# EAGLE design TLC5955 (EAGLE 7.4.0)
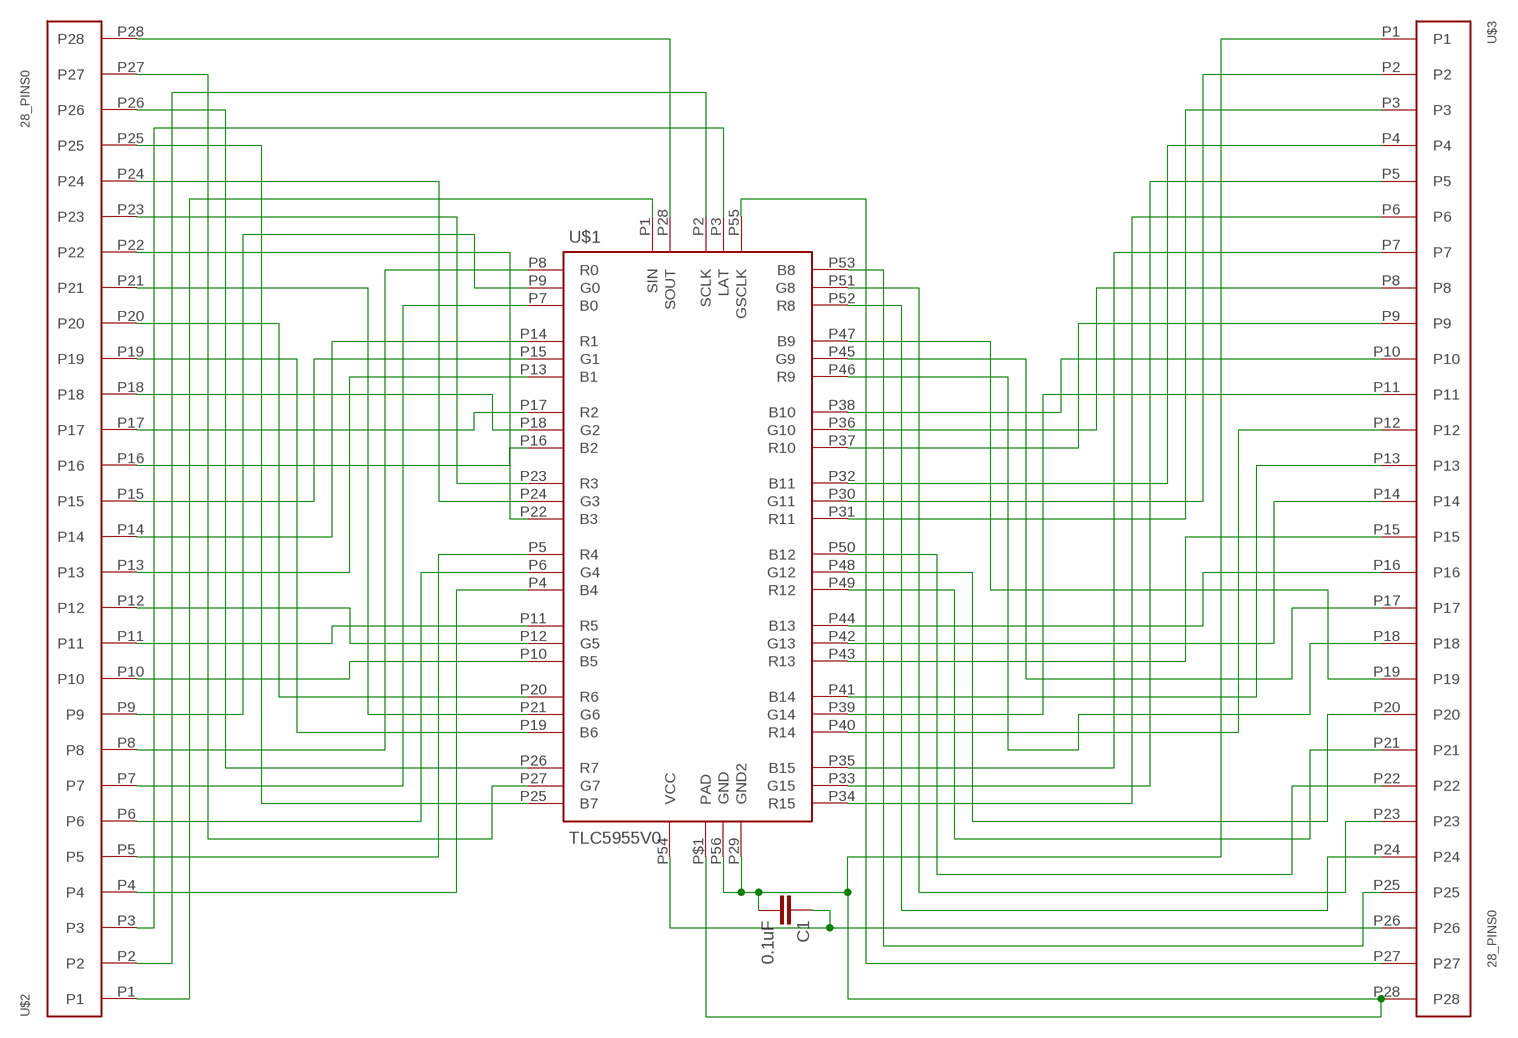
[diagram p0: schematic, sheet 1]

## Parts
C1  0.1uF  0.1UF-25V(+80/-20%)(0603)  [0603-CAP]
U$1  TLC5955V0  [56-HTSSOP]
U$2  28_PINS0  [28PIN_HOLES]
U$3  28_PINS0  [28PIN_HOLES]

## Nets
N$1: U$1.P4(B4) U$2.P4
N$2: U$1.P5(R4) U$2.P5
N$3: U$1.P6(G4) U$2.P6
N$4: U$1.P7(B0) U$2.P7
N$5: U$1.P8(R0) U$2.P8
N$6: U$1.P21(G6) U$2.P21
N$7: U$1.P10(B5) U$2.P10
N$8: U$1.P11(R5) U$2.P11
N$9: U$1.P12(G5) U$2.P12
N$10: U$1.P13(B1) U$2.P13
N$11: U$1.P14(R1) U$2.P14
N$12: U$1.P15(G1) U$2.P15
N$13: U$1.P16(B2) U$2.P16
N$14: U$1.P17(R2) U$2.P17
N$15: U$1.P18(G2) U$2.P18
N$16: U$1.P19(B6) U$2.P19
N$17: U$1.P20(R6) U$2.P20
N$18: U$1.P22(B3) U$2.P22
N$19: U$1.P23(R3) U$2.P23
N$20: U$1.P24(G3) U$2.P24
N$21: U$1.P9(G0) U$2.P9
N$22: U$1.P25(B7) U$2.P25
N$23: U$1.P26(R7) U$2.P26
N$24: U$1.P28(SOUT) U$2.P28
N$25: U$1.P27(G7) U$2.P27
N$26: U$1.P1(SIN) U$2.P1
N$27: U$1.P2(SCLK) U$2.P2
N$28: U$1.P3(LAT) U$2.P3
N$30: U$1.P47(B9) U$3.P19
N$31: C1.1 U$1.P54(VCC) U$3.P26
N$33: U$1.P30(G11) U$3.P2
N$34: U$1.P31(R11) U$3.P3
N$35: U$1.P32(B11) U$3.P4
N$36: U$1.P33(G15) U$3.P5
N$37: U$1.P34(R15) U$3.P6
N$38: U$1.P35(B15) U$3.P7
N$39: U$1.P36(G10) U$3.P8
N$40: U$1.P37(R10) U$3.P9
N$41: U$1.P38(B10) U$3.P10
N$42: U$1.P39(G14) U$3.P11
N$43: U$1.P40(R14) U$3.P12
N$44: U$1.P41(B14) U$3.P13
N$45: U$1.P42(G13) U$3.P14
N$46: U$1.P43(R13) U$3.P15
N$47: U$1.P44(B13) U$3.P16
N$48: U$1.P45(G9) U$3.P17
N$49: U$1.P46(R9) U$3.P18
N$50: U$1.P48(G12) U$3.P20
N$51: U$1.P49(R12) U$3.P21
N$52: U$1.P50(B12) U$3.P22
N$53: U$1.P51(G8) U$3.P23
N$54: U$1.P52(R8) U$3.P24
N$55: U$1.P53(B8) U$3.P25
N$56: U$1.P55(GSCLK) U$3.P27
N$57: C1.2 U$1.P29(GND2) U$1.P56(GND) U$1.P$1(PAD) U$3.P1 U$3.P28

## Library data of the parts
C1 = SparkFun-Capacitors:0.1UF-25V(+80/-20%)(0603): CAP-00810 Ceramic Standard decoupling cap; PROD_ID: CAP-00810
U$1 = WallerLabLib:TLC5955
U$2 U$3 = WallerLabLib:28_PINS

## Board
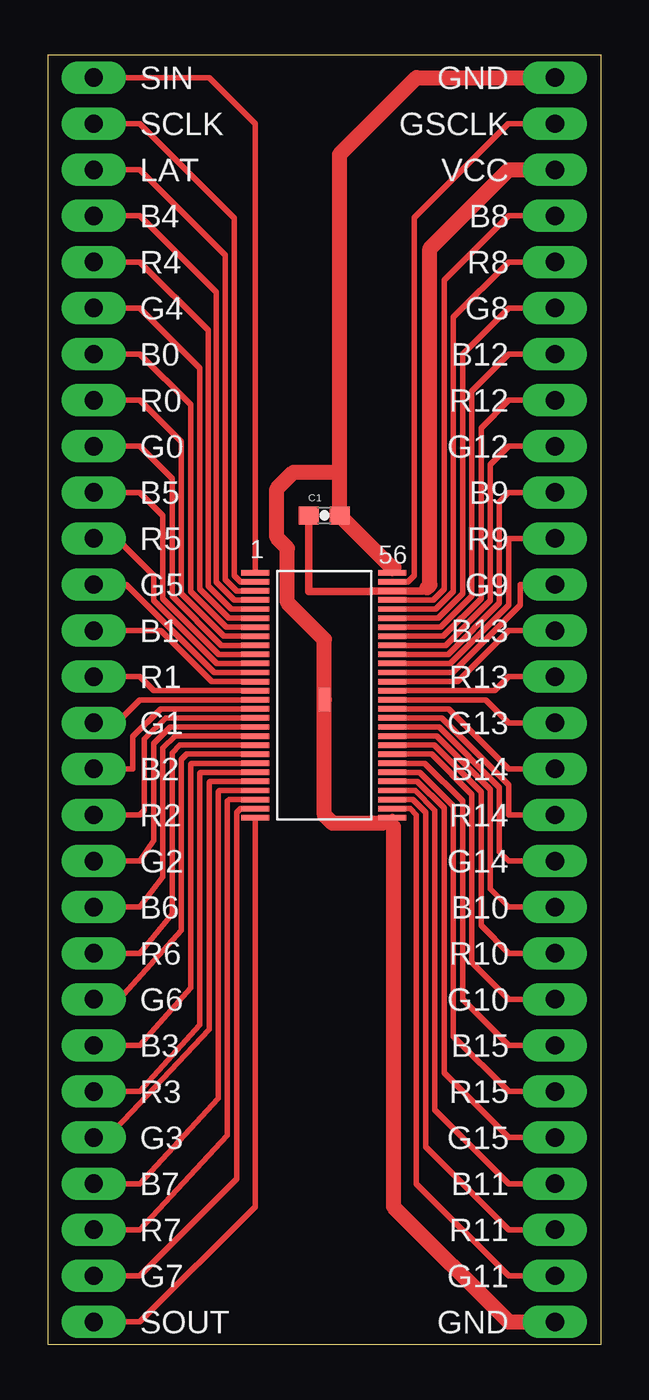
[diagram p1: board, top side]

Size 30.48 x 71.12 mm. Coordinates in mm from the lower left corner, seen from the top.
Outline: 0,71.11 0,0 30.48,0 30.48,71.12 0,71.12
Copper layers (1*16): Top 0.035mm / dielectric 1.5mm / Bottom 0.035mm
Design rules "default": minimum track width 10mil, minimum drill 24mil, track to track 8mil, track to pad 8mil, pad to pad 8mil, via to via 8mil, smd to smd 8mil, copper to edge 40mil, drill to drill 8mil, minimum pad ring 10mil, minimum via ring 8mil, stop-mask expansion 4mil, vias tented up to drill 0mil, thermal gap 10mil

### Footprints (pad centres in the part's own frame; a part is rotated, then mirrored left to right if it is on the bottom)
0603-CAP = smd 1.1 x 1: 1 -0.85,0; 2 0.85,0
56-HTSSOP = smd 0.3 x 1.55: P1 -7,-3.8; P2 -6.5,-3.8; P3 -6,-3.8; P4 -5.5,-3.8; P5 -5,-3.8; P6 -4.5,-3.8; P7 -4,-3.8; P8 -3.5,-3.8; P9 -3,-3.8; P10 -2.5,-3.8; P11 -2,-3.8; P12 -1.5,-3.8; P13 -1,-3.8; P14 -0.5,-3.8; P15 0,-3.8; P16 0.5,-3.8; P17 1,-3.8; P18 1.5,-3.8; P19 2,-3.8; P20 2.5,-3.8; P21 3,-3.8; P22 3.5,-3.8; P23 4,-3.8; P24 4.5,-3.8; P25 5,-3.8; P26 5.5,-3.8; P27 6,-3.8; P28 6.5,-3.8; P29 6.5,3.75; P30 6,3.75; P31 5.5,3.75; P32 5,3.75; P33 4.5,3.75; P34 4,3.75; P35 3.5,3.75; P36 3,3.75; P37 2.5,3.75; P38 2,3.75; P39 1.5,3.75; P40 1,3.75; P41 0.5,3.75; P42 0,3.75; P43 -0.5,3.75; P44 -1,3.75; P45 -1.5,3.75; P46 -2,3.75; P47 -2.5,3.75; P48 -3,3.75; P49 -3.5,3.75; P50 -4,3.75; P51 -4.5,3.75; P52 -5,3.75; P53 -5.5,3.75; P54 -6,3.75; P55 -6.5,3.75; P56 -7,3.75 | smd 1.27 x 0.635: P$1 0,0
28PIN_HOLES = drill 1.016 pad 1.778 long: P1 -34.29,0; P2 -31.75,0; P3 -29.21,0; P4 -26.67,0; P5 -24.13,0; P6 -21.59,0; P7 -19.05,0; P8 -16.51,0; P9 -13.97,0; P10 -11.43,0; P11 -8.89,0; P12 -6.35,0; P13 -3.81,0; P14 -1.27,0; P15 1.27,0; P16 3.81,0; P17 6.35,0; P18 8.89,0; P19 11.43,0; P20 13.97,0; P21 16.51,0; P22 19.05,0; P23 21.59,0; P24 24.13,0; P25 26.67,0; P26 29.21,0; P27 31.75,0; P28 34.29,0

### Placement (x,y rotation side)
C1  10uF  [0603-CAP]  15.24,45.72 0 top
U$1  15.24,35.56 270 top
U$2  2.54,35.56 270 top
U$3  27.94,35.56 90 top

### Tracks (layer width: path | path; a pad name or v marks a point on that pad's centre or on a via)
N$1
  Top 0.305: U$1.P4 10.27,41.06 9.3,42.04 9.3,58.01 5.08,62.23 U$2.P4
N$2
  Top 0.305: U$1.P5 10.11,40.56 8.84,41.83 8.84,55.93 5.08,59.69 U$2.P5
N$3
  Top 0.305: U$1.P6 9.98,40.06 8.38,41.66 8.38,53.85 5.08,57.15 U$2.P6
N$4
  Top 0.305: U$1.P7 9.84,39.56 7.87,41.53 7.87,51.82 5.08,54.61 U$2.P7
N$5
  Top 0.305: U$1.P8 9.71,39.06 7.37,41.4 7.37,49.78 5.08,52.07 U$2.P8
N$6
  Top 0.305: U$2.P21 3.94,19.05 7.37,22.86 7.37,32.26 7.67,32.56 U$1.P21
N$7
  Top 0.305: U$1.P10 9.44,38.06 6.35,41.15 6.35,45.72 5.08,46.99 U$2.P10
N$8
  Top 0.305: U$1.P11 9.3,37.56 5.84,41.02 5.84,42.42 3.81,44.45 U$2.P11
N$9
  Top 0.305: U$1.P12 9.17,37.06 4.32,41.91 U$2.P12
N$10
  Top 0.305: U$1.P13 9.03,36.56 6.22,39.37 U$2.P13
N$11
  Top 0.305: U$1.P14 5.85,36.06 5.08,36.83 U$2.P14
N$12
  Top 0.305: U$1.P15 5.08,35.56 3.81,34.29 U$2.P15
N$13
  Top 0.305: U$2.P16 4.7,31.75 4.7,33.53 6.22,35.05 U$1.P16
N$14
  Top 0.305: U$1.P17 6.49,34.56 5.33,33.4 5.33,29.46 5.08,29.21 U$2.P17
N$15
  Top 0.305: U$2.P18 5.08,26.67 5.84,27.81 5.84,33.15 6.75,34.06 U$1.P18
N$16
  Top 0.305: U$2.P19 5.08,24.13 6.35,25.78 6.35,32.89 7.02,33.56 U$1.P19
N$17
  Top 0.305: U$2.P20 5.08,21.59 6.86,23.75 6.86,32.64 7.28,33.06 U$1.P20
N$18
  Top 0.305: U$2.P22 5.08,16.51 7.87,19.68 7.87,32 7.93,32.06 U$1.P22
N$19
  Top 0.305: U$2.P23 5.08,13.97 8.38,17.65 8.38,31.5 8.45,31.56 U$1.P23
N$20
  Top 0.305: U$2.P24 3.3,11.43 8.89,17.4 8.89,30.99 8.96,31.06 U$1.P24
N$21
  Top 0.305: U$1.P9 9.57,38.56 6.86,41.27 6.86,47.75 5.08,49.53 U$2.P9
N$22
  Top 0.305: U$2.P25 5.08,8.89 9.4,13.59 9.4,30.48 9.48,30.56 U$1.P25
N$23
  Top 0.305: U$2.P26 5.08,6.35 9.91,11.56 9.91,29.97 9.99,30.06 U$1.P26
N$24
  Top 0.305: U$2.P28 5.08,1.27 11.43,7.62 U$1.P28
N$25
  Top 0.305: U$1.P27 10.64,29.56 10.41,29.34 10.41,9.14 5.08,3.81 U$2.P27
N$26
  Top 0.305: U$2.P1 8.89,69.85 11.43,67.31 U$1.P1
N$27
  Top 0.305: U$1.P2 10.64,42.06 10.29,42.42 10.29,62.1 5.08,67.31 U$2.P2
N$28
  Top 0.305: U$1.P3 10.41,41.56 9.78,42.19 9.78,60.07 5.08,64.77 U$2.P3
N$30
  Top 0.305: U$1.P47 22.06,38.06 24.89,40.89 24.89,46.48 25.4,46.99 U$3.P19
N$31
  Top 0.406: C1.1 14.39,41.53 17.8,41.53 17.8,41.56 U$1.P54 20.65,41.55 20.83,41.73 20.9,41.73
  Top 0.813: U$3.P26 25.4,64.77 21.06,60.43 21.06,41.88 20.9,41.73
N$33
  Top 0.305: U$1.P30 19.97,29.56 20.32,29.21 20.32,8.89 25.4,3.81 U$3.P2
N$34
  Top 0.305: U$1.P31 20.11,30.06 20.83,29.34 20.83,10.92 25.4,6.35 U$3.P3
N$35
  Top 0.305: U$1.P32 20.24,30.56 21.34,29.46 21.34,12.95 25.4,8.89 U$3.P4
N$36
  Top 0.305: U$1.P33 20.38,31.06 21.84,29.59 21.84,14.99 25.4,11.43 U$3.P5
N$37
  Top 0.305: U$1.P34 20.51,31.56 22.35,29.72 22.35,17.02 25.4,13.97 U$3.P6
N$38
  Top 0.305: U$1.P35 20.77,32.06 22.86,29.97 22.86,19.05 25.4,16.51 U$3.P7
N$39
  Top 0.305: U$1.P36 21.16,32.56 23.37,30.35 23.37,21.08 25.4,19.05 U$3.P8
N$40
  Top 0.305: U$1.P37 21.3,33.06 23.88,30.48 23.88,23.11 25.4,21.59 U$3.P9
N$41
  Top 0.305: U$1.P38 21.43,33.56 24.38,30.61 24.38,25.15 25.4,24.13 U$3.P10
N$42
  Top 0.305: U$1.P39 21.57,34.06 24.89,30.73 24.89,27.18 25.4,26.67 U$3.P11
N$43
  Top 0.305: U$1.P40 21.7,34.56 25.4,30.86 25.4,29.21 U$3.P12
N$44
  Top 0.305: U$1.P41 22.09,35.06 25.4,31.75 U$3.P13
N$45
  Top 0.305: U$1.P42 24.13,35.56 25.4,34.29 U$3.P14
N$46
  Top 0.305: U$1.P43 24.63,36.06 25.4,36.83 U$3.P15
N$47
  Top 0.305: U$1.P44 22.59,36.56 25.4,39.37 U$3.P16
N$48
  Top 0.305: U$1.P45 22.33,37.06 26.04,40.77 26.04,41.91 U$3.P17
N$49
  Top 0.305: U$1.P46 22.19,37.56 25.4,40.77 25.4,44.45 U$3.P18
N$50
  Top 0.305: U$1.P48 21.92,38.56 24.38,41.02 24.38,48.51 25.4,49.53 U$3.P20
N$51
  Top 0.305: U$1.P49 21.79,39.06 23.88,41.15 23.88,50.55 25.4,52.07 U$3.P21
N$52
  Top 0.305: U$1.P50 21.65,39.56 23.37,41.27 23.37,52.58 25.4,54.61 U$3.P22
N$53
  Top 0.305: U$1.P51 21.52,40.06 22.86,41.4 22.86,54.61 25.4,57.15 U$3.P23
N$54
  Top 0.305: U$1.P52 21.38,40.56 22.35,41.53 22.35,56.64 25.4,59.69 U$3.P24
N$55
  Top 0.305: U$1.P53 21.25,41.06 21.84,41.66 21.84,58.67 25.4,62.23 U$3.P25
N$56
  Top 0.305: U$3.P27 25.38,67.31 20.19,62.13 20.19,42.42 19.84,42.06 U$1.P55
N$57
  Top 0.406: 18.99,29.01 U$1.P29 | 18.99,29.01 19.05,29.01 19.05,28.55 | 18.99,29.01 18.69,29.01 18.44,28.75 | U$1.P56 18.99,42.76 19.07,42.85
  Top 0.813: 19.05,28.55 19.05,7.62 25.4,1.27 U$3.P1 | 18.44,28.75 15.7,28.75 15.24,29.21 U$1.P$1 15.24,38.89 13.21,40.92 13.21,43.92 12.62,44.5 12.62,47.19 13.54,48.11 16.04,48.11 16.09,48.16 | 19.07,42.85 18.96,42.85 C1.2 16.09,48.16 | 16.09,48.16 16.09,65.62 20.32,69.85 U$3.P28

### Text on the board
tPlace: GND | SIN | GSCLK | SCLK | VCC | LAT | B8 | B4 | R8 | R4 | G8 | G4 | B12 | B0 | R12 | R0 | G12 | G0 | B9 | B5 | R9 | R5 | G9 | G5 | B13 | B1 | R13 | R1 | G13 | G1 | B14 | B2 | R14 | R2 | G14 | G2 | B10 | B6 | R10 | R6 | G10 | G6 | B15 | B3 | R15 | R3 | G15 | G3 | B11 | B7 | R11 | R7 | G11 | G7 | GND | SOUT